# EAGLE design breakout (EAGLE 6.3)
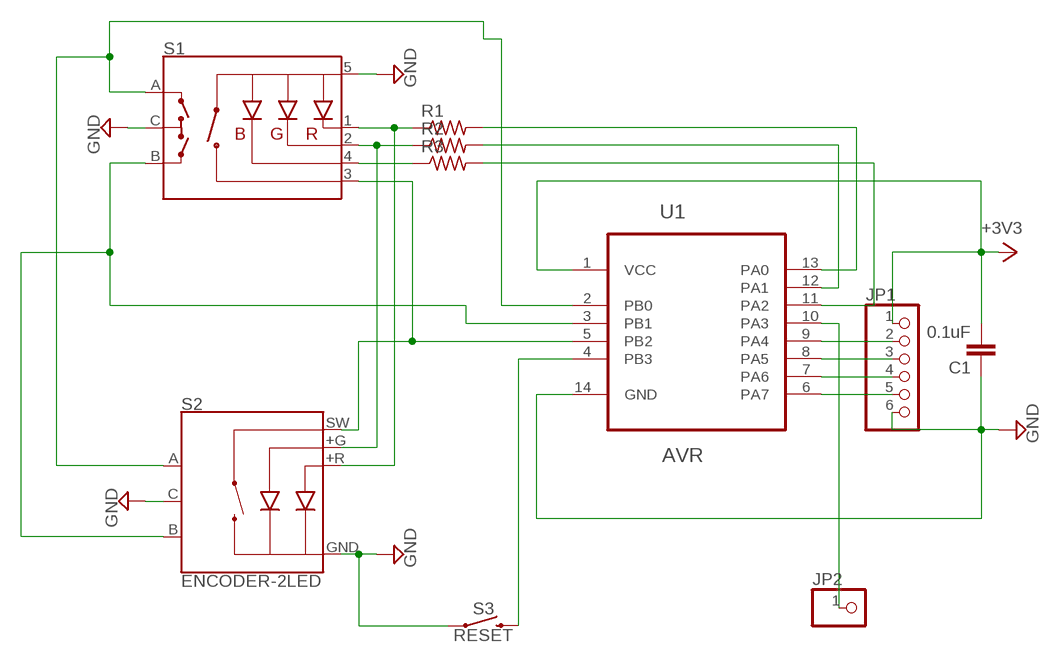
[diagram p0: schematic, sheet 1]

## Parts
C1  0.1uF  0.1UF-0603-25V-5%  [0603]
JP1  PINHD-1X6  [1X06]
JP2  PINHD-1X1  [1X01]
R1  R-US_M1206  [M1206]
R2  R-US_M1206  [M1206]
R3  R-US_M1206  [M1206]
S1  ENCODER-RGB-SWITCH  [ENCODER_LED_3]
S2  ENCODER-2LED  [ENCODER_LED_2]
S3  RESET  MOMENTARY-SWITCH-SPST-SMD-4.5MM  [TACTILE_SWITCH_SMD_4.5MM]
U1  AVR  ATTINY24-20SSU  [SOIC127P600X175-14N]

## Nets
+3V3: C1.2 JP1.1 U1.1(VCC)
GND: C1.1 JP1.6 S1.5(+) S1.C S2.C S2.GND(-) S3.2 S3.3 U1.14(GND)
N$1: JP1.2 U1.9(PA4)
N$2: JP1.3 U1.8(PA5)
N$3: JP1.4 U1.7(PA6)
N$4: JP1.5 U1.6(PA7)
N$5: S1.A S2.A U1.2(PB0)
N$6: S1.B S2.B U1.3(PB1)
N$9: S1.3(SW) S2.SW U1.5(PB2)
N$10: R1.1 S1.1(-R) S2.+R
N$11: R2.1 S1.2(-G) S2.+G
N$12: R3.1 S1.4(-B)
N$15: R1.2 U1.13(PA0)
N$16: R2.2 U1.12(PA1)
N$17: R3.2 U1.11(PA2)
N$18: S3.1 S3.4 U1.4(PB3)
N$19: JP2.1 U1.10(PA3)

## Library data of the parts
C1 = SparkFun-Capacitors:0.1UF: 0.1µF ceramic capacitors A capacitor is a passive two-terminal electrical component used to store electrical energy temporarily in an electric field.; PROD_ID: CAP-08604
JP1 = pinhead:PINHD-1X6: PIN HEADER
JP2 = pinhead:PINHD-1X1: PIN HEADER
R1-R3 = resistor:R-US_: RESISTOR, American symbol
S1 = SparkFun-Switches:ENCODER-RGB-SWITCH: Illuminated Rotary Encoder w/ RGB LED and select switch Encoders rotate similarly to potentiometers, but they’re different from potentiometers in that an encoder has full rotation without limits. They output gray code so that you can tell how much and in which direction the encoder has been turned. This encoder includes an RGB LED and a push-down select switch. Part #: Top Up EC12PLRGBSDVBF-D <http://top-up.so-buy.com/front/bin/ptdetail.phtml?Part=EC12PLRGBSDVBF-D> SparkFun Products Rotary Encoder - Illuminated (RGB) <https://www.sparkfun.com/products/10982> (COM-10982); PROD_ID: RES-10859; SF_SKU: COM-10982
S2 = SparkFun-Switches:ENCODER-2LED: Illuminated Rotary Encoder w/ 2 LEDs Rotary encoders rotate similarly to potentiometers, but they’re different from potentiometers in that an encoder has full rotation without limits. They output gray code so that you can tell how much and in which direction the encoder has been turned. This encoder has a red/green LED built-in, which shines through the encoder shaft. SparkFun Products Rotary Encoder - Illuminated (Red/Green) <https://www.sparkfun.com/products/10596> (COM-10596) SparkFun Rotary Encoder Breakout - Illuminated (RG/RGB) <https://www.sparkfun.com/products/11722> (BOB-11722); PROD_ID: COMP-11113; SF_SKU: COM-10596
S3 = SparkFun-Switches:MOMENTARY-SWITCH-SPST: Momentary Switch (Pushbutton) - SPST Normally-open (NO) SPST momentary switches (buttons, pushbuttons). Variants PTH-12MM - 12mm square, through-hole Momentary Pushbutton Switch - 12mm Square <https://www.sparkfun.com/products/9190> (COM-09190) PTH-6.0MM, PTH-6.0MM-KIT - 6.0mm square, through-hole Mini Pushbutton Switch <https://www.sparkfun.com/products/97> (COM-00097) KIT package intended for soldering kit's - only one side of pads' copper is exposed. PTH-RIGHT-ANGLE-KIT - Right-angle, through-hole Right Angle Tactile Button <https://www.sparkfun.com/products/10791> - Used on SparkFun BigTime Watch Kit <https://www.sparkfun.com/products/11734> SMD-12MM - 12mm square, surface-mount Tactile Button - SMD (12mm) <https://www.sparkfun.com/products/12993> (COM-12993) Used on SparkFun PicoBoard <https://www.sparkfun.com/products/11888> SMD-4.5MM - 4.5mm Square Trackball Switch Used on SparkFun Blackberry Trackballer Breakout <https://www.sparkfun.com/products/13169> SMD-4.6MMX2.8MM - 4.60mm x 2.80mm, surface mount Used on SparkFun SAMD21 Mini Breakout <https://www.sparkfun.com/products/13664> SMD-5.2MM, SMD-5.2-REDUNDANT - 5.2mm square, surface-mount Mini Pushbutton Switch - SMD <https://www.sparkfun.com/products/8720> (COM-08720) Used on Arduino Pro Mini <https://www.sparkfun.com/products/11114> REDUNDANT package connects both switch circuits together SMD-6.0X3.5MM - 6.0 x 3.5mm, surface mount Momentary Reset Switch SMD <https://www.sparkfun.com/products/8229> (COM-08229) SMD-6.2MM-TALL - 6.2mm square, surface mount Tactile Button - SMD (6mm) <https://www.sparkfun.com/products/12992> Used on SparkFun Digital Sandbox <https://www.sparkfun.com/products/12651> SMD-RIGHT-ANGLE - Right-angle, surface mount Used on SparkFun Block for Intel® Edison - Arduino <https://www.sparkfun.com/products/13036>; PROD_ID: SWCH-09213
U1 = Atmel_By_element14_Batch_1-00:ATTINY24-20SSU: 8-bit Microcontroller with Bytes In-System Programmable Flash; MPN: ATTINY24-20SSU; OC_FARNELL: 1455137; OC_NEWARK: 58M3775; PACKAGE: SOIC-14; SUPPLIER: Atmel

## Board
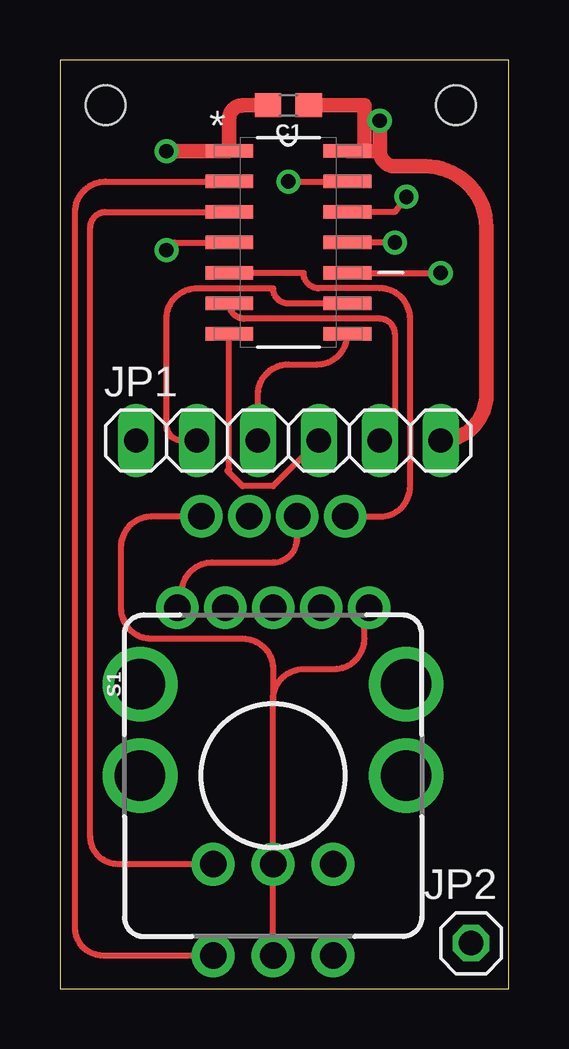
[diagram p1: board, top side]
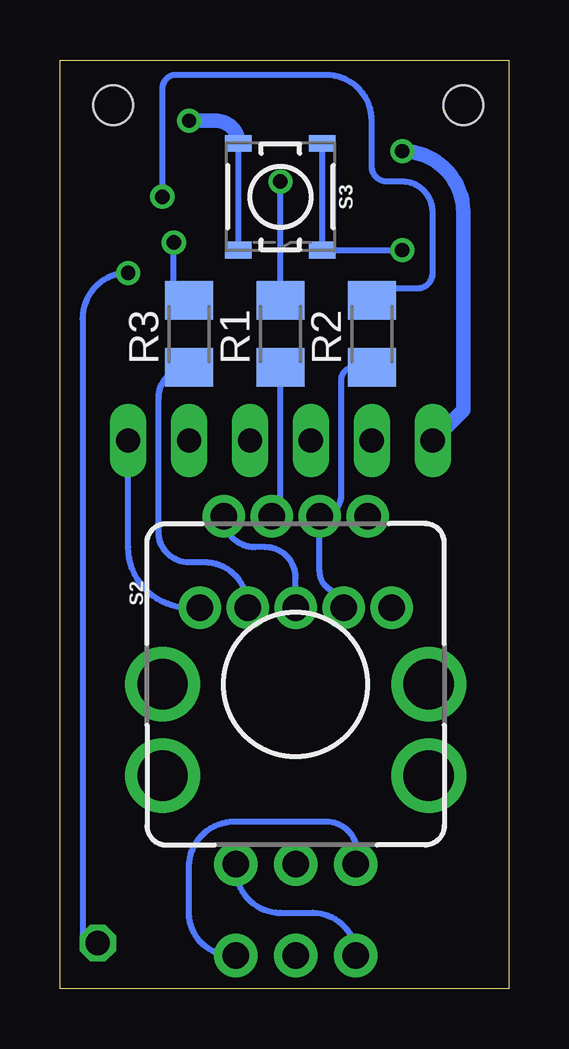
[diagram p2: board, bottom side, seen from below]

Size 18.72 x 38.73 mm. Coordinates in mm from the lower left corner, seen from the top.
Outline: 0,0 18.72,0 18.72,38.73 0,38.73 0,0
Copper layers (1*16): Top 0.035559375mm / dielectric 60mil / Bottom 0.035559375mm
Design rules "default *": minimum track width 6mil, minimum drill 13mil, track to track 6mil, track to pad 7mil, pad to pad 7mil, via to via 7mil, smd to smd 6mil, copper to edge 15mil, drill to drill 6mil, minimum pad ring 10mil, minimum via ring 8mil, stop-mask expansion 4mil, vias tented up to drill 0mil, thermal gap 10mil
Holes 1.65 mm at 1.91,36.83 16.51,36.83

### Footprints (pad centres in the part's own frame; a part is rotated, then mirrored left to right if it is on the bottom)
0603 = smd 1.1 x 1: 1 -0.85,0; 2 0.85,0
1X06 = drill 1.016 long: 1 -6.35,0; 2 -3.81,0; 3 -1.27,0; 4 1.27,0; 5 3.81,0; 6 6.35,0
1X01 = drill 1.016 octagon: 1 0,0
M1206 = smd 1.6 x 2: 1 -1.4,0; 2 1.4,0
ENCODER_LED_3 = drill 1.1 pad 1.778: 1 -4,7; 2 -2,7; 3 0,7; 4 2,7; 5 4,7 | drill 1.1 pad 1.8: A -2.5,-7.5; B 2.5,-7.5; C 0,-7.5 | drill 2.1: M1 -5.55,0; M2 5.55,0
ENCODER_LED_2 = drill 1.1 pad 1.778: +G 1,7; +R -1,7; GND 3,7; SW -3,7 | drill 1.1 pad 1.8: A -2.5,-7.5; B 2.5,-7.5; C 0,-7.5 | drill 2.1: P$1 -5.55,0; P$2 5.55,0
TACTILE_SWITCH_SMD_4.5MM = smd 0.7 x 1.1: 1 2.225,1.75; 2 2.225,-1.75; 3 -2.225,-1.75; 4 -2.225,1.75
SOIC127P600X175-14N = smd 1.981 x 0.559: 1 -2.464,3.81; 2 -2.464,2.54; 3 -2.464,1.27; 4 -2.464,0; 5 -2.464,-1.27; 6 -2.464,-2.54; 7 -2.464,-3.81; 8 2.464,-3.81; 9 2.464,-2.54; 10 2.464,-1.27; 11 2.464,0; 12 2.464,1.27; 13 2.464,2.54; 14 2.464,3.81

### Placement (x,y rotation side)
C1  9.53,36.83 180 top
JP1  9.53,22.86 0 top
JP2  17.14,1.91 0 top
R1  9.53,27.3 90 bottom
R2  5.71,27.3 90 bottom
R3  13.34,27.3 90 bottom
S1  8.89,8.89 0 top
S2  8.89,12.7 0 bottom
S3  9.53,33.02 270 bottom
U1  9.53,31.11 0 top

### Tracks (layer width: path | path; a pad name or v marks a point on that pad's centre or on a via)
+3V3  (via drill 0.6)
  Top 0.61: C1.2 7.62,36.83 arc90 7.06,36.27 U1.1 v4.45,34.92
  Bottom 0.61: JP1.1 1.91,24.13 1.91,32.38 arc-90 v4.45,34.92
GND  (via drill 0.6)
  Top 0.254: S1.C S2.C 8.89,12.06 | 8.89,12.06 arc-90 10.16,13.34 11.43,13.34 arc90 12.7,14.61 12.7,15.7 arc-90 S1.5 | S2.GND arc-90 5.88,19.68 3.81,19.68 arc90 2.54,18.41 2.54,15.88 arc90 3.81,14.61 7.62,14.61 arc-90 8.89,13.34 8.89,12.06
  Top 0.61: 13.34,34.92 12.7,34.92 | 12.7,34.92 U1.14 | C1.1 12.7,36.83 12.7,34.92 | v13.34,36.2 13.34,34.92 | JP1.6 arc90 17.78,24.77 17.78,31.75 arc90 15.24,34.29 13.97,34.29 arc-90 13.34,34.92
  Bottom 0.254: S3.2 S3.3 | S1.5 13.35,15.89 arc90 15.88,18.41 JP1.6
  Bottom 0.61: S3.3 arc-90 12.22,36.2 v13.34,36.2
N$1
  Top 0.254: JP1.2 5.08,22.86 arc-90 4.45,23.5 4.45,27.94 arc-90 5.71,29.21 8.89,29.21 arc90 9.53,28.57 U1.9
N$2
  Top 0.254: JP1.3 8.26,24.77 arc-90 9.53,26.04 10.72,26.04 arc90 U1.8
N$3
  Top 0.254: JP1.4 8.89,20.95 7.62,20.95 6.99,21.59 7.06,21.67 U1.7
N$4
  Top 0.254: U1.6 arc90 7.7,27.94 13.34,27.94 arc-90 13.97,27.3 13.97,22.86 JP1.5
N$5
  Top 0.254: S1.A 1.78,1.39 arc-90 0.64,2.54 0.64,32.38 arc-90 1.91,33.66 U1.2
  Bottom 0.254: S2.A 11.39,5.04 arc-90 9.53,3.17 8.18,3.17 arc90 S1.A
N$6
  Top 0.254: S2.B 2.42,5.2 arc-90 1.27,6.35 1.27,31.75 arc-90 1.91,32.38 U1.3
  Bottom 0.254: S1.B 11.55,1.39 arc90 13.34,3.17 13.34,5.08 arc90 11.43,6.99 7.62,6.99 arc90 6.35,5.71 6.35,5.24 arc90 S2.B
N$9
  Top 0.254: S2.SW 12.69,19.7 12.7,19.68 13.34,19.68 arc90 14.61,20.95 14.61,27.94 arc90 13.34,29.21 10.79,29.21 arc-90 10.16,29.84 U1.5
  Bottom 0.254: S1.3 8.89,17.14 arc-90 10.16,18.41 10.61,18.41 arc90 S2.SW 11.89,19.51
N$10
  Top 0.254: S1.1 arc90 5.08,16.08 5.08,16.51 arc-90 6.35,17.78 8.89,17.78 arc90 9.89,18.78 S2.+R
  Bottom 0.254: S2.+R 9.53,20.07 R1.1
N$11
  Bottom 0.254: R2.1 6.48,25.91 arc-90 6.99,25.4 6.99,20.61 arc90 S2.+G 7.89,17.41 arc-90 6.99,16.51 6.99,15.98 S1.2
N$12
  Bottom 0.254: 13.34,25.4 R3.1 arc-90 14.61,24.64 14.61,19.05 arc-90 13.34,17.78 12.7,17.78 arc90 10.89,15.97 S1.4
N$15  (via drill 0.6)
  Top 0.254: v9.53,33.66 U1.13
  Bottom 0.254: R1.2 v9.53,33.66
N$16  (via drill 0.6)
  Top 0.254: v14.45,33.02 13.97,32.38 U1.12
  Bottom 0.254: R2.2 5.21,29.21 3.81,29.21 arc-90 3.17,29.84 3.17,32.38 arc-90 4.45,33.66 5.08,33.66 arc90 5.71,34.29 5.71,36.2 arc-90 7.62,38.1 13.97,38.1 arc-90 14.45,37.47 v14.45,33.02
N$17  (via drill 0.6)
  Top 0.254: v13.97,31.11 U1.11
  Bottom 0.254: R3.2 13.97,29.34 v13.97,31.11
N$18  (via drill 0.6)
  Top 0.254: v4.45,30.8 4.76,31.11 U1.4
  Bottom 0.254: v4.45,30.8 S3.1 S3.4
N$19  (via drill 0.6)
  Top 0.254: U1.10 v15.88,29.84
  Bottom 0.254: v15.88,29.84 arc-90 17.78,27.94 17.78,1.91 JP2.1